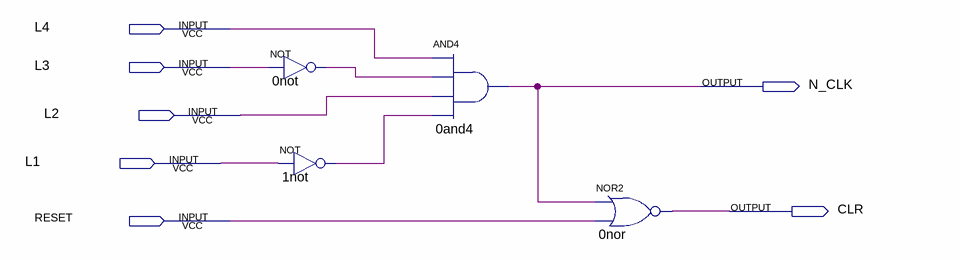
[diagram p0: schematic sheet]
// Quartus schematic NEXT_CLK.bdf as structural Verilog: 4 symbols, 7 pins
module NEXT_CLK (
  input  L4,
  input  L3,
  input  L2,
  input  L1,
  input  RESET,
  output N_CLK,
  output CLR
);

  wire n0not_out, n1not_out;

  not u_0not (n0not_out, L3);
  not u_1not (n1not_out, L1);
  and u_0and4 (N_CLK, L4, n0not_out, L2, n1not_out);
  nor u_0nor (CLR, N_CLK, RESET);
endmodule
